# Altium project Motor_Mod_v1.0.PrjPcb
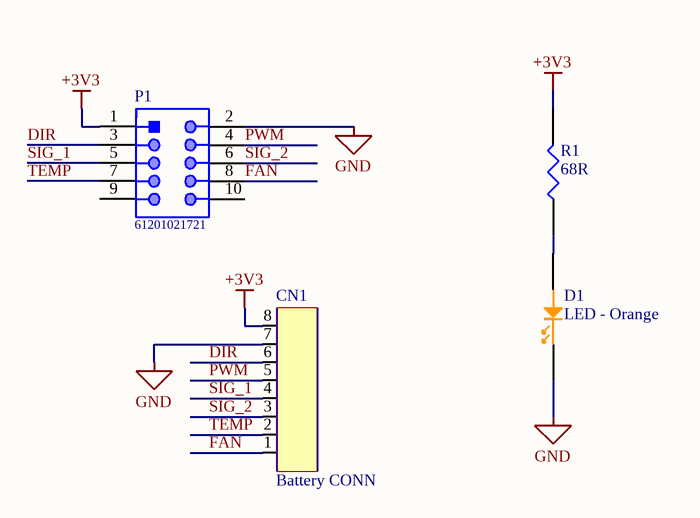
[diagram p0: Motor_Mod_v1.0.SchDoc]
1 sheet, 4 parts. Net scope: global (net labels, ports and power ports of the same name join across sheets).
Board file: Motor_Mod_v1.0.PcbDoc

## Sheet Motor_Mod_v1.0.SchDoc
size A4

### Parts
CN1  Battery CONN  [1747785-1]
D1  LED - Orange  [LED0603-Orange]
P1  61201021721  [61201021721]
R1  68R  [68R 0603]

### Nets
+3V3: CN1.8 P1.1 R1.2
GND: CN1.7 D1.1(Cathode) P1.2
DIR: CN1.6 P1.3
FAN: CN1.1 P1.8
PWM: CN1.5 P1.4
SIG_1: CN1.4 P1.5
SIG_2: CN1.3 P1.6
TEMP: CN1.2 P1.7
NetD1_2: D1.2(Anode) R1.1

Not connected (* = marked no-connect by the designer): P1 9 10

### Library data of the parts
CN1 = 1747785-1
D1 = LTST-C191KFKT: LED ORANGE CLEAR SMD; Manufacturer: Vishay Lite-On; Lens Color: Colorless; Wavelength: 611nm; Number of LEDs: 1; Viewing Angle: 130°; Lens Style: Diffused,Colorless,Rectangular; Luminous Intensity: 90mcd; Forward Current: 30mA; Forward Voltage: 2V; Power Rating: 75mW; Reverse Voltage: 5V; Dominant Wavelength: 605nm; Test Current: 20mA; Supplier 1: Digi-Key; Supplier Part Number 1: 160-1445-1-ND; Manufacturer Part Number: LTST-C191KFKT; RoHS: Yes; Category: LEDs; Stock 1: 92562; Pricing 1: 1=0.24000, 10=0.17900, 100=0.08460, 500=0.05640, 1000=0.04418, 2500=0.04324 (USD); Mount: Surface Mount; Case/Package: 0603; Number of Pins: 2; Case Code (Metric): 1608; Color: Orange; Case Code (Imperial): 0603; Min Operating Temperature: -55°C; Max Operating Temperature: 85°C; Package Quantity: 1; Packaging: Tape and Reel; Illumination Color: Orange; Lens Transparency: Clear; Number of Elements: 1; Power Dissipation: 75mW; Length: 1.6mm; Height: 0.55mm; Width: 0.8mm; Depth: 0.8mm; Radiation Hardening: No; Lead Free: Lead Free; ComponentLink1URL: https://datasheet.ciiva.com/2109/ltst-c191kfkt-2109968.pdf?src-supplier=Digi-Key; ComponentLink1Description: https://datasheet.ciiva.com/2109/ltst-c191kfkt-2109968.pdf?src-supplier=Digi-Key; ComponentLink2URL: https://datasheet.ciiva.com/12400/100-ltst-c191kfkt-39904-12400811.pdf?src-supplier=Mouser; ComponentLink2Description: https://datasheet.ciiva.com/12400/100-ltst-c191kfkt-39904-12400811.pdf?src-supplier=Mouser; ComponentLink3URL: https://datasheet.ciiva.com/11775/0900766b80dc02b0-11775613.pdf?src-supplier=RSComponents; ComponentLink3Description: https://datasheet.ciiva.com/11775/0900766b80dc02b0-11775613.pdf?src-supplier=RSComponents; ComponentLink4URL: https://datasheet.ciiva.com/15201/getdatasheetpartid-631075-15201391.pdf?src-supplier=Verical; ComponentLink4Description: https://datasheet.ciiva.com/15201/getdatasheetpartid-631075-15201391.pdf?src-supplier=Verical; ComponentLink5URL: https://datasheet.ciiva.com/2109/s-110-ltst-c191kfkt-2109969.pdf?src-supplier=Digi-Key; ComponentLink5Description: https://datasheet.ciiva.com/2109/s-110-ltst-c191kfkt-2109969.pdf?src-supplier=Digi-Key
P1 = CMP-1502-00021-1: Male Box Header WR-BHD, THT, Angled, pitch 2.54 mm, 10 pins; Manufacturer: Wurth Elektronik; Pin Number: 10; Contact Resistance: 20mOhm; Working Voltage: 250VAC; Pitch: 2.54mm; Withstanding Voltage: 500VAC; Mounting Technology: THT; Publisher: WurthElektronik; Gender: Male; Part Number: 61201021721; Package Reference: 61201021721; Orientation: Angled; Published Date: August2018; Packaging: Tray; Manufacturer URL: http://www.we-online.de; Operating Temperature: -40to125degC; Datasheet URL: https://katalog.we-online.de/em/datasheet/6120xx21721.pdf
R1 = CRGP0603F68R: CRGP 0603 68R 1%; Manufacturer: TE Connectivity; Max Power Dissipation: 250mW; Temperature Coefficient: 200ppm/°C; Supplier 1: Digi-Key; Supplier Part Number 1: A130402CT-ND; Manufacturer Part Number: CRGP0603F68R; RoHS: No; Category: Chip SMD Resistors; Stock 1: 49308; Pricing 1: 1=0.14000, 10=0.11400, 100=0.04470, 1000=0.01870, 2500=0.01714 (USD); Case/Package: 0603; Case Code (Imperial): 0603; Case Code (Metric): 1608; Min Operating Temperature: -55°C; Max Operating Temperature: 155°C; Resistor Type: Thick Film; Packaging: Tape and Reel; Resistance: 68R; Tolerance: 1%; Number of Terminations: 2; ComponentLink1URL: https://www.te.com/commerce/DocumentDelivery/DDEController?Action=srchrtrv&amp;DocNm=9-1773463-9&amp;DocType=DS&amp;DocLang=English&src-supplier=Digi-Key; ComponentLink1Description: https://www.te.com/commerce/DocumentDelivery/DDEController?Action=srchrtrv&amp;DocNm=9-1773463-9&amp;DocType=DS&amp;DocLang=English&src-supplier=Digi-Key